# EAGLE design UsbKerb (EAGLE 7.5.0)
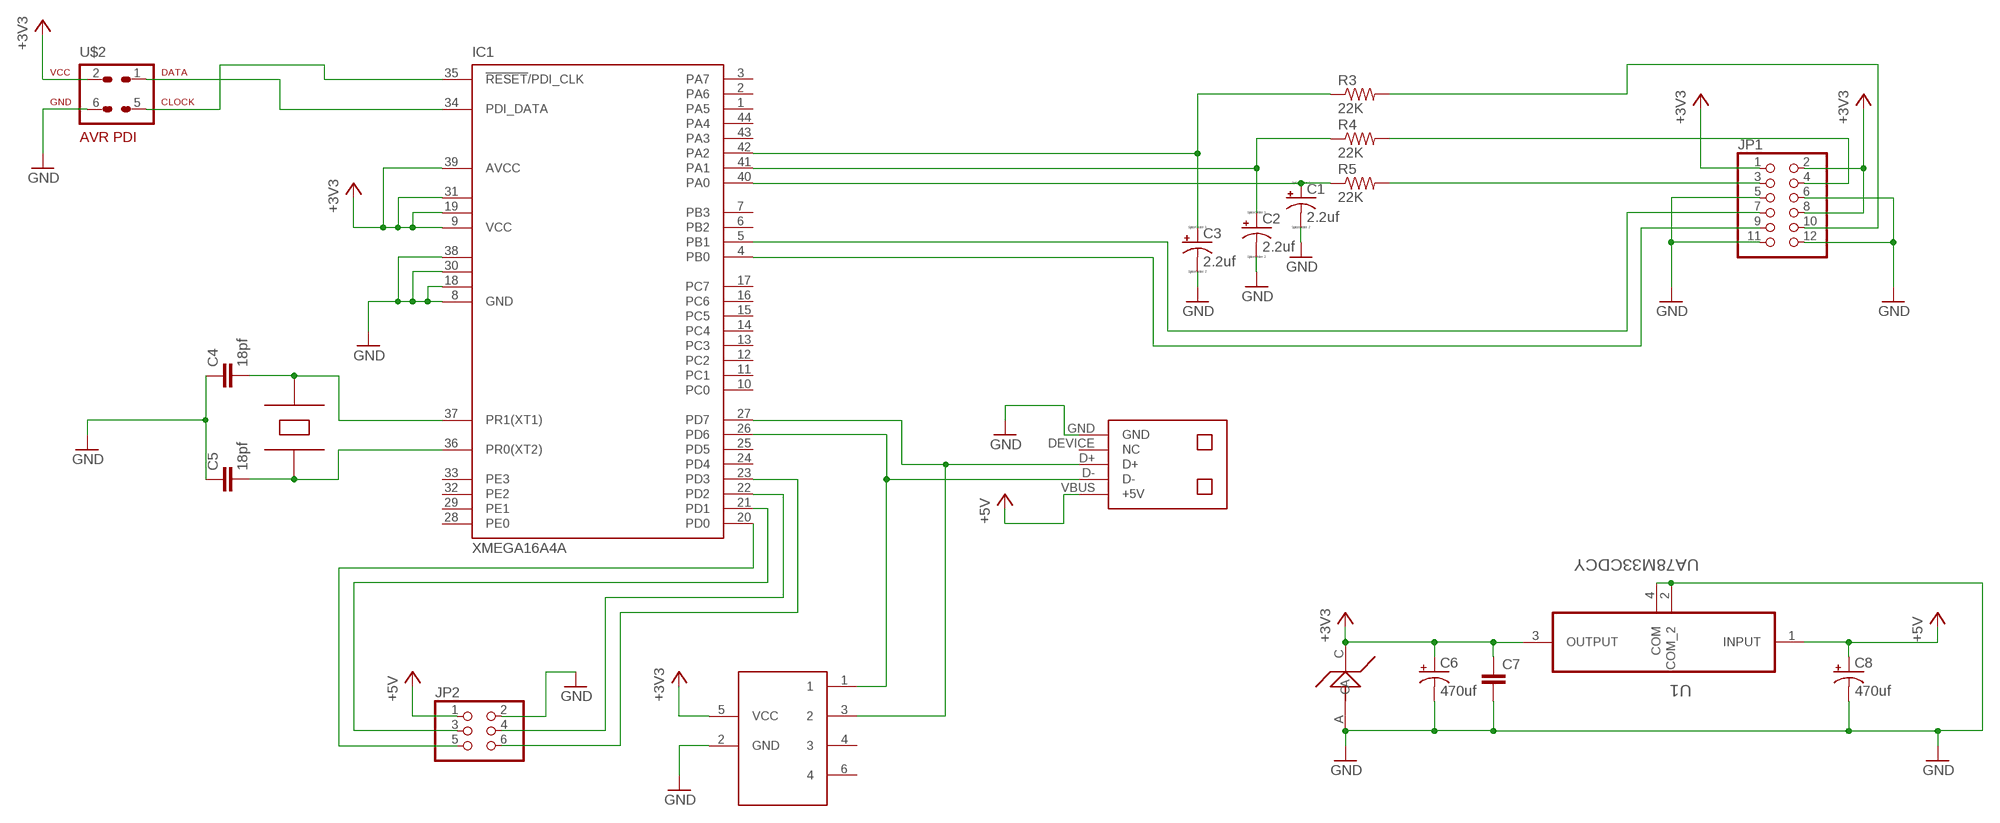
[diagram p0: schematic, sheet 1]

## Parts
C1  2.2uf  CPOL-USB  [PANASONIC_B]
C2  2.2uf  CPOL-USB  [PANASONIC_B]
C3  2.2uf  CPOL-USB  [PANASONIC_B]
C4  18pf  C-EUC0805K  [C0805K]
C5  18pf  C-EUC0805K  [C0805K]
C6  470uf  CPOL-USG  [PANASONIC_G]
C7  C-EUC1206K  [C1206K]
C8  470uf  CPOL-USG  [PANASONIC_G]
IC1  XMEGA16A4A  [TQFP44]
JP1  PINHD-2X6  [2X06]
JP2  PINHD-2X3  [2X03]
R3  22K  R-US_R0805W  [R0805W]
R4  22K  R-US_R0805W  [R0805W]
R5  22K  R-US_R0805W  [R0805W]
U1  UA78M33CDCY  [SOT230P700X180-4N]
U2  3.3TVS  [SOT23-6L]
U$1  USB-MINI  [USB-MINI]
U$2  AVR-PDIVERT  [AVR-ISP-6]
U$3  TVS  [DO214AC]
U$4  12MHZ  [12MHZ]

## Nets
+3V3: C6.+ C7.1 IC1.9(VCC) IC1.19(VCC1) IC1.31(VCC2) IC1.39(AVCC) JP1.1 JP1.2 JP1.8 U1.3(OUTPUT) U2.5(VCC) U$2.2 U$3.C
+5V: C8.+ JP2.1 U1.1(INPUT) U$1.VBUS(+5V)
GND: C1.- C2.- C3.- C4.1 C5.1 C6.- C7.2 C8.- IC1.8(GND) IC1.18(GND1) IC1.30(GND2) IC1.38(GND3) JP1.5 JP1.6 JP1.11 JP1.12 JP2.2 U1.2(COM_2) U1.4(COM) U2.2(GND) U$1.GND U$2.6 U$3.A
N$1: C1.+ IC1.40(PA0) R5.1
N$2: IC1.27(PD7) U2.3 U$1.D+
N$3: IC1.34(PDI_DATA) U$2.1
N$4: IC1.26(PD6) U2.1 U$1.D-
N$5: C2.+ IC1.41(PA1) R4.1
N$6: C3.+ IC1.42(PA2) R3.1
N$7: IC1.35(!RESET!/PDI_CLK) U$2.5
N$8: JP1.10 R3.2
N$9: JP1.4 R4.2
N$10: JP1.3 R5.2
N$11: IC1.4(PB0) JP1.9
N$12: IC1.5(PB1) JP1.7
N$13: C4.2 IC1.37(PR1(XT1)) U$4.P$1
N$14: C5.2 IC1.36(PR0(XT2)) U$4.P$2
N$16: IC1.22(PD2) JP2.4
N$17: IC1.20(PD0) JP2.5
N$18: IC1.21(PD1) JP2.3
N$19: IC1.23(PD3) JP2.6
Unconnected: IC1.1(PA5) IC1.2(PA6) IC1.3(PA7) IC1.6(PB2) IC1.7(PB3) IC1.10(PC0) IC1.11(PC1) IC1.12(PC2) IC1.13(PC3) IC1.14(PC4) IC1.15(PC5) IC1.16(PC6) IC1.17(PC7) IC1.24(PD4) IC1.25(PD5) IC1.28(PE0) IC1.29(PE1) IC1.32(PE2) IC1.33(PE3) IC1.43(PA3) IC1.44(PA4) U2.4 U2.6 U$1.DEVICE(NC)

## Library data of the parts
C1-C3 = resistor:CPOL-US: POLARIZED CAPACITOR, American symbol
C4 C5 = rcl:C-EU: CAPACITOR, European symbol
C6 C8 = rcl:CPOL-US: POLARIZED CAPACITOR, American symbol
C7 = resistor:C-EU: CAPACITOR, European symbol
IC1 = atmel:XMEGA16A4: MICROCONTROLLER Features High-performance, Low-power 8/16-bit AVR XMEGA Microcontroller Non-Volatile Program and Data Memories - 16 KB - 128 KB of In-System Self-Programmable Flash - 4 KB - 8 KB Boot Code Section with Independent Lock Bits - 1 KB - 2 KB EEPROM - 2 KB - 8 KB Internal SRAM Peripheral Features - Four-channel DMA Controller with support for external requests - Eight-channel Event System - Five 16-bit Timer/Counters Three Timer/Counters with 4 Output Compare or Input Capture channels Two Timer/Counters with 2 Output Compare or Input Capture channels High-Resolution Extensions on all Timer/Counters Advanced Waveform Extension on one Timer/Counter - Five USARTs IrDA Extension on one USART - Two Two-Wire Interfaces with dual address match (I2C and SMBus compatible) - Two SPIs (Serial Peripheral Interfaces) peripherals - AES and DES Crypto Engine - 16-bit Real Time Counter with Separate Oscillator - One Twelve-channel, 12-bit, 2 Msps Analog to Digital Converter - One Two-channel, 12-bit, 1 Msps Digital to Analog Converter - Two Analog Comparators with Window compare function - External Interrupts on all General Purpose I/O pins - Programmable Watchdog Timer with Separate On-chip Ultra Low Power Oscillator Special Microcontroller Features - Power-on Reset and Programmable Brown-out Detection - Internal and External Clock Options with PLL - Programmable Multi-level Interrupt Controller - Sleep Modes: Idle, Power-down, Standby, Power-save, Extended Standby - Advanced Programming, Test and Debugging Interfaces PDI (Program and Debug Interface) for programming, test and debugging I/O and Packages - 34 Programmable I/O Lines - 44 - lead TQFP - 44 - pad VQFN/QFN - 49 - ball VFBGA Operating Voltage - 1.6 - 3.6V Speed performance - 0 - 12 MHz @ 1.6 - 3.6V - 0 - 32 MHz @ 2.7 - 3.6V Drawn by Dipl.-Ing. (FH) Robert Siegler Created: 27.05.09; OC_FARNELL: unknown; OC_NEWARK: unknown
JP1 = pinhead:PINHD-2X6: PIN HEADER
JP2 = pinhead:PINHD-2X3: PIN HEADER
R3-R5 = resistor:R-US_: RESISTOR, American symbol
U1 = usb:UA78M33CDCY: IC, LINEAR VOLT REGULATOR, 3.3V, SOT-223-4; MPN: UA78M33CDCY; OC_FARNELL: 2296031; OC_NEWARK: 03P0895; PACKAGE: SOT-223-4; SUPPLIER: TEXAS INSTRUMENTS
U2 = usb:3.3TVS
U$1 = usb:USB-MINI
U$2 = avr-7:AVR-PDI: AVR PDI programming interface connector
U$3 = usb:TVS
U$4 = usb:12MHZ

## Board
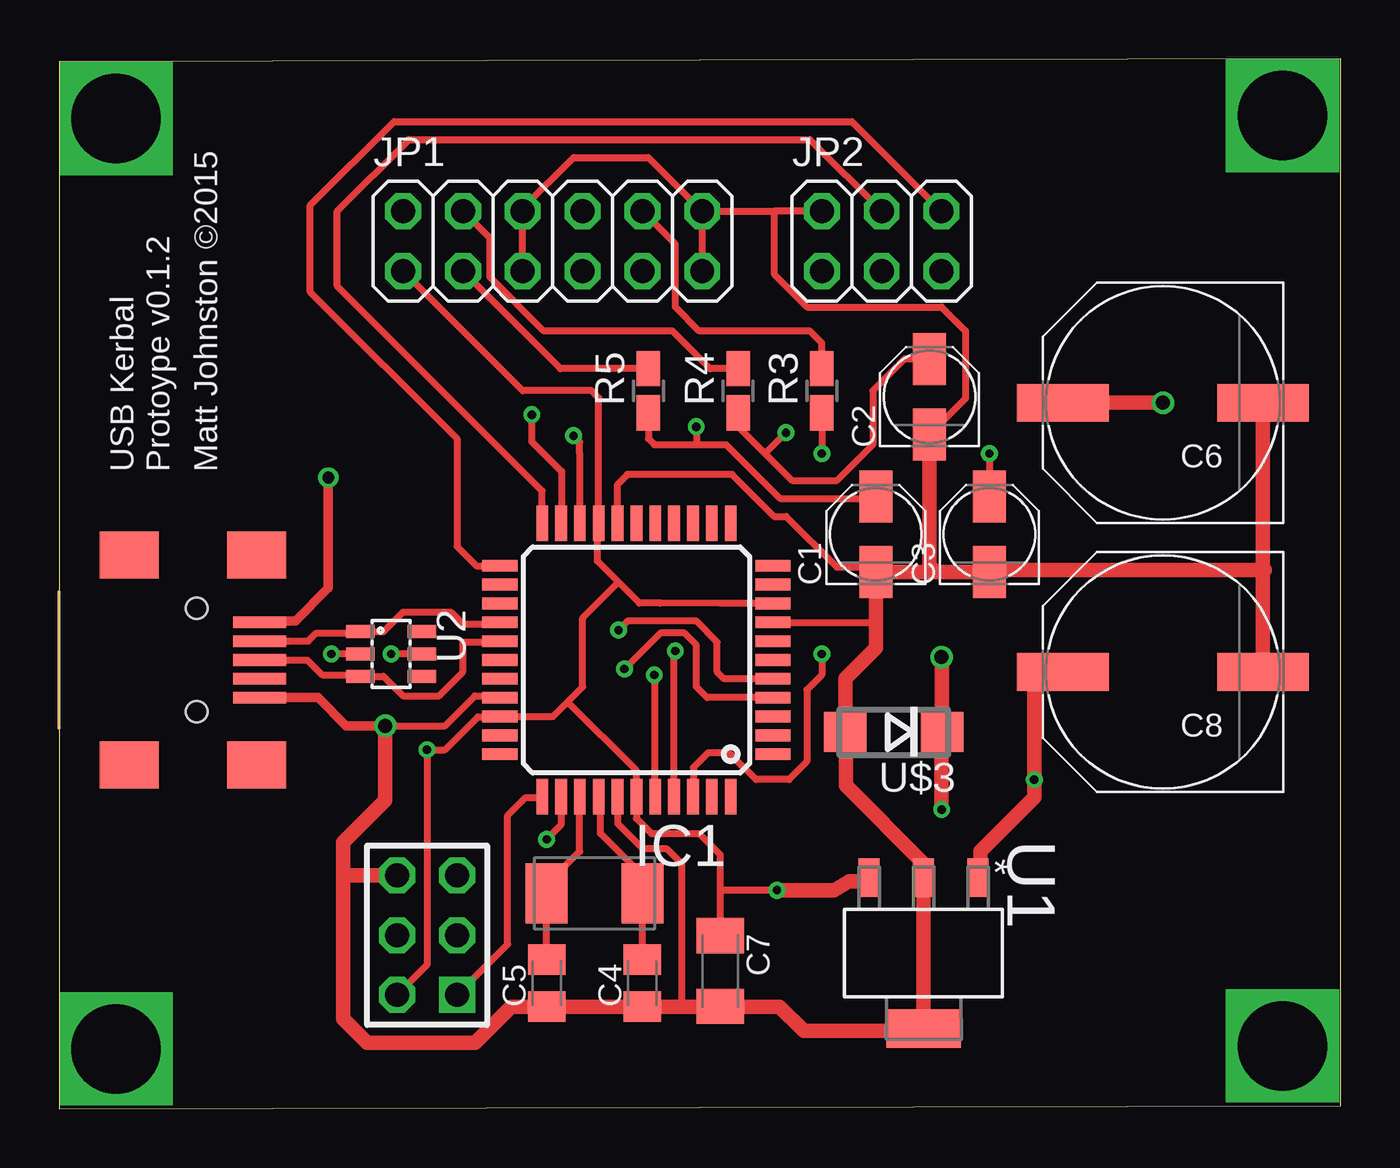
[diagram p1: board, top side]
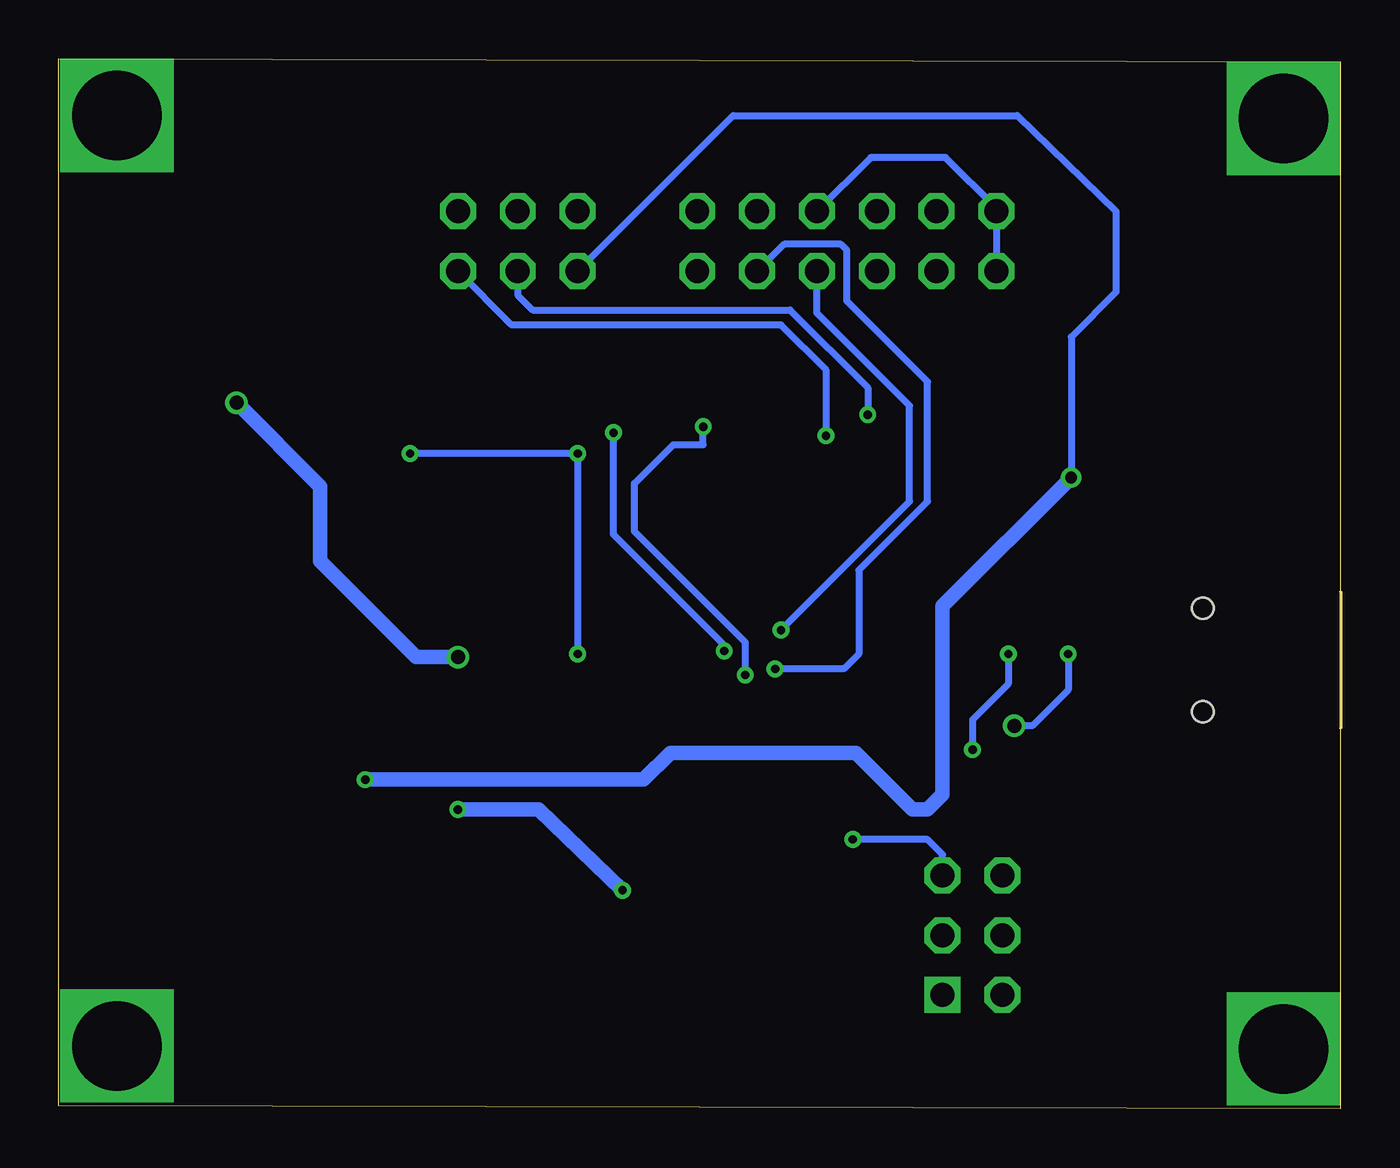
[diagram p2: board, bottom side, seen from below]

Size 54.41 x 44.57 mm. Coordinates in mm from the lower left corner, seen from the top.
Outline: 0.01,0 54.41,0.13 54.41,44.57 0.01,44.44 0.01,0
Copper layers (1*16): Top 0.0356mm / dielectric 1.5011mm / Bottom 0.0356mm
Design rules "LaenPCBOrder": minimum track width 6mil, minimum drill 13mil, track to track 6mil, track to pad 6mil, pad to pad 6mil, via to via 6mil, smd to smd 6mil, copper to edge 15mil, drill to drill 6mil, minimum pad ring 7mil, minimum via ring 7mil, stop-mask expansion 3mil, vias tented up to drill 0mil, thermal gap 10mil

### Footprints (pad centres in the part's own frame; a part is rotated, then mirrored left to right if it is on the bottom)
PANASONIC_B = smd 2.2 x 1.4: + 1.6,0; - -1.6,0
C0805K = smd 1.3 x 1.6: 1 -1,0; 2 1,0
PANASONIC_G = smd 3.9 x 1.6: + 4.25,0; - -4.25,0
C1206K = smd 1.5 x 2: 1 -1.5,0; 2 1.5,0
TQFP44 = smd 1.5 x 0.5: 1 -5.8,4; 2 -5.8,3.2; 3 -5.8,2.4; 4 -5.8,1.6; 5 -5.8,0.8; 6 -5.8,0; 7 -5.8,-0.8; 8 -5.8,-1.6; 9 -5.8,-2.4; 10 -5.8,-3.2; 11 -5.8,-4; 23 5.8,-4; 24 5.8,-3.2; 25 5.8,-2.4; 26 5.8,-1.6; 27 5.8,-0.8; 28 5.8,0; 29 5.8,0.8; 30 5.8,1.6; 31 5.8,2.4; 32 5.8,3.2; 33 5.8,4 | smd 0.5 x 1.5: 12 -4,-5.8; 13 -3.2,-5.8; 14 -2.4,-5.8; 15 -1.6,-5.8; 16 -0.8,-5.8; 17 0,-5.8; 18 0.8,-5.8; 19 1.6,-5.8; 20 2.4,-5.8; 21 3.2,-5.8; 22 4,-5.8; 34 4,5.8; 35 3.2,5.8; 36 2.4,5.8; 37 1.6,5.8; 38 0.8,5.8; 39 0,5.8; 40 -0.8,5.8; 41 -1.6,5.8; 42 -2.4,5.8; 43 -3.2,5.8; 44 -4,5.8
2X06 = drill 1.016 octagon: 1 -6.35,-1.27; 2 -6.35,1.27; 3 -3.81,-1.27; 4 -3.81,1.27; 5 -1.27,-1.27; 6 -1.27,1.27; 7 1.27,-1.27; 8 1.27,1.27; 9 3.81,-1.27; 10 3.81,1.27; 11 6.35,-1.27; 12 6.35,1.27
2X03 = drill 1.016 octagon: 1 -2.54,-1.27; 2 -2.54,1.27; 3 0,-1.27; 4 0,1.27; 5 2.54,-1.27; 6 2.54,1.27
R0805W = smd 1.5 x 1: 1 -0.94,0; 2 0.94,0
SOT230P700X180-4N = smd 1.626 x 0.889: 1 -3.2,2.311; 2 -3.2,0; 3 -3.2,-2.311 | smd 1.626 x 3.175: 4 3.2,0
SOT23-6L = smd 0.55 x 1.2: 1 -0.95,-1.3; 2 0,-1.3; 3 0.95,-1.3; 4 0.95,1.3; 5 0,1.3; 6 -0.95,1.3
USB-MINI = smd 0.5 x 2.25: D+ 0,2.675; D- -0.8,2.675; DEVICE 0.8,2.675; GND 1.6,2.675; VBUS -1.6,2.675 | smd 2 x 2.5: P$6 -4.45,-2.87; P$7 4.45,2.55; P$8 4.45,-2.87; P$9 -4.45,2.55 | hole 0.9: 2.2,0; -2.2,0
AVR-ISP-6 = drill 1.016 square: 1 -2.54,-1.27 | drill 1.016 octagon: 2 -2.54,1.27; 3 0,-1.27; 4 0,1.27; 5 2.54,-1.27; 6 2.54,1.27
DO214AC = smd 1.8 x 1.7: A 2.05,0; C -2.05,0
12MHZ = smd 1.778 x 2.54: P$1 -2.032,0; P$2 2.032,0

### Placement (x,y rotation side)
C1  34.68,24.38 90 top
C2  36.97,30.23 90 top
C3  39.51,24.38 90 top
C4  24.77,5.33 90 top
C5  20.71,5.33 90 top
C6  46.87,29.97 180 top
C7  28.08,5.84 270 top
C8  46.87,18.54 180 top
IC1  24.52,19.05 180 top
JP1  20.96,36.83 0 top
JP2  34.93,36.83 0 top
R3  32.39,30.48 90 top
R4  28.84,30.48 90 top
R5  25.03,30.48 90 top
U1  36.71,6.6 270 top
U2  14.1,19.3 270 top
U$1  5.85,19.05 270 top
U$2  15.63,7.37 90 top
U$3  35.44,16 180 top
U$4  22.74,9.14 180 top

### Tracks (layer width: path | path; a pad name or v marks a point on that pad's centre or on a via)
+3V3  (via drill 0.36 pad 0.18, 0.36 pad 0.41, 0.6)
  Top 0.305: IC1.9 28.09,21.45 25.54,21.46 24.65,21.46 23.76,22.35 | 23.76,22.35 22.87,23.24 22.87,24.8 IC1.19 22.92,30.18 22.61,30.48 19.69,30.48 JP1.1 | 21.6,17.27 20.98,16.65 IC1.31 18.71,16.64 17.79,16.64 16.39,15.24 v15.63,15.24 15.63,6.1 U$2.2 | 21.6,17.27 22.23,17.91 22.23,20.83 23.76,22.35 | 21.6,17.27 24.52,14.35 IC1.39 24.52,12.32 25.15,11.68 27.19,11.68 28.08,10.79 28.08,9.14 | U2.5 v14.1,19.3 | v30.49,9.27 28.2,9.27 28.08,9.14 | 28.08,9.14 C7.1
  Top 0.61: v37.47,12.7 37.47,15.98 U$3.C 37.49,19.16 v37.47,19.18 | v46.87,29.97 C6.+ | v30.49,9.27 32.9,9.27 33.54,9.65 34.25,9.65 U1.3
  Bottom 0.305: JP1.1 JP1.2 14.61,38.23 16.77,40.39 19.95,40.39 JP1.8 | v14.1,19.3 14.1,18.03 15.63,16.51 v15.63,15.24
  Bottom 0.61: v37.47,12.7 34.04,12.7 v30.49,9.27 | v37.47,19.18 39.25,19.18 43.32,23.24 43.32,26.42 v46.87,29.97
+5V  (via drill 0.36 pad 0.41, 0.5 pad 0.25)
  Top 0.406: v11.44,26.8 11.44,22.1 10.04,20.7 8.58,20.7 U$1.VBUS
  Top 0.61: C8.+ 41.41,18.54 v41.41,13.97 41.41,13.21 39.12,10.92 39.12,9.91 U1.1
  Bottom 0.305: JP2.1 25.79,42.16 13.72,42.16 9.53,38.1 9.53,34.67 11.44,32.77 v11.44,26.8
  Bottom 0.61: v41.41,13.97 29.6,13.97 28.46,15.11 20.58,15.11 18.17,12.7 17.53,12.7 16.9,13.34 16.9,21.34 v11.44,26.8
GND  (via drill 0.36 pad 0.18, 0.6)
  Top 0.305: U2.2 v11.56,19.3 | v13.85,16.26 16.39,16.26 17.66,17.53 18.64,17.53 IC1.30 | IC1.8 34.6,20.65 34.68,20.57 | JP1.5 JP1.6 19.69,38.23 21.85,40.39 25.03,40.39 JP1.12 | JP1.12 JP1.11 | JP1.12 30.36,38.1 | JP2.2 30.36,38.1 | 30.36,38.1 30.36,35.43 31.76,34.04 37.47,34.04 38.49,33.02 38.49,30.15 C2.- | IC1.38 23.72,12.1 24.77,11.05 25.79,11.05 26.42,10.41 26.42,4.46 26.55,4.33 | IC1.18 23.72,26.5 24.14,26.92 28.58,26.92 30.36,25.15 30.87,25.15 33.03,22.99 34.48,22.99 C1.-
  Top 0.406: U$1.GND 11.01,17.45 12.2,16.26 v13.85,16.26
  Top 0.61: 12.07,9.91 12.07,3.81 13.09,2.79 17.66,2.79 19.2,4.33 C5.1 C4.1 26.55,4.33 C7.2 28.08,4.33 30.6,4.33 31.63,3.3 36.61,3.3 U1.4 U1.2 36.71,10.41 33.41,13.72 33.41,15.98 U$3.A 33.39,18.27 34.68,19.56 34.68,20.57 C1.- 37.22,22.78 | 12.07,9.91 12.07,11.3 13.85,13.08 v13.85,16.26 | C6.- C8.- 51.12,22.79 51.19,22.86 39.58,22.86 C3.- 37.22,22.78 | C2.- 36.97,23.04 37.22,22.78 | U$2.6 12.07,9.91
  Bottom 0.305: v11.56,19.3 11.56,17.78 13.09,16.26 v13.85,16.26
N$1  (via drill 0.36 pad 0.18)
  Top 0.305: R5.1 25.03,28.45 25.28,28.19 27.06,28.19 | 27.06,28.19 28.33,28.19 30.62,25.91 34.6,25.91 C1.+ | v27.06,28.96 27.06,28.19 | v25.28,18.41 25.28,13.29 IC1.40
  Bottom 0.305: v27.06,28.96 27.06,28.19 28.33,28.19 29.98,26.54 29.98,24.51 25.28,19.81 v25.28,18.41
N$2
  Top 0.305: IC1.27 18.68,19.81 17.15,19.81 17.15,18.54 16.14,17.53 14.61,17.53 13.79,18.35 U2.3 12.74,18.41 11.18,18.41 10.55,19.05 U$1.D+
N$3
  Top 0.305: U$2.1 19.06,6.99 19.06,12.45 19.82,13.21 20.48,13.21 IC1.34
N$4
  Top 0.305: IC1.26 18.64,20.57 17.15,20.57 16.65,21.08 14.61,21.08 13.79,20.25 U2.1 12.74,20.19 10.93,20.19 10.59,19.85 U$1.D-
N$5  (via drill 0.36 pad 0.18)
  Top 0.305: C2.+ 35.9,31.83 34.55,30.48 34.55,28.19 33.03,26.67 31.12,26.67 29.98,27.81 | IC1.41 26.12,19.38 v26.17,19.43 | R4.1 28.84,28.96 29.98,27.81 | v30.87,28.7 29.98,27.81
  Bottom 0.305: v30.87,28.7 30.87,24.38 26.17,19.68 v26.17,19.43
N$6  (via drill 0.36 pad 0.18)
  Top 0.305: R3.1 v32.39,27.81 | v39.51,27.81 C3.+ | v32.39,19.3 32.39,18.41 31.76,17.78 31.76,14.73 31,13.97 29.6,13.97 28.46,15.11 27.57,15.11 26.93,14.48 26.93,13.26 IC1.42
  Bottom 0.305: v32.39,19.3 v32.39,27.81 v39.51,27.81
N$7  (via drill 0.36 pad 0.18)
  Top 0.305: 21.34,13.22 IC1.35 21.32,12.04 v20.71,11.43
  Bottom 0.305: U$2.5 16.9,10.79 17.53,11.43 v20.71,11.43
N$8
  Top 0.305: R3.2 32.39,32.51 31.89,33.02 27.19,33.02 26.17,34.04 26.17,36.7 JP1.10
N$9
  Top 0.305: R4.2 27.64,31.42 26.04,33.02 20.58,33.02 18.3,35.31 18.3,36.96 JP1.4
N$10
  Top 0.305: R5.2 21.29,31.42 JP1.3
N$11  (via drill 0.36 pad 0.18)
  Top 0.305: IC1.4 27.52,17.45 27.06,17.91 27.06,19.68 26.55,20.19 25.54,20.19 v24.01,18.67
  Bottom 0.305: JP1.9 23.63,36.7 21.22,36.7 20.96,36.45 20.96,34.29 17.53,30.86 17.53,25.78 20.45,22.86 20.45,19.3 21.09,18.67 v24.01,18.67
N$12  (via drill 0.36 pad 0.18)
  Top 0.305: IC1.5 28.24,18.25 27.95,18.54 27.95,19.81 27.06,20.7 24.14,20.7 v23.76,20.32
  Bottom 0.305: v23.76,20.32 18.3,25.78 18.3,29.84 22.23,33.78 JP1.7
N$13
  Top 0.305: IC1.37 22.99,13.17 22.99,11.68 24.77,9.91 U$4.P$1 C4.2
N$14
  Top 0.305: C5.2 U$4.P$2 20.71,9.91 21.09,9.91 22.11,10.92 22.11,13.24 IC1.36
N$16
  Top 0.305: IC1.22 20.52,26.23 11.82,34.92 11.82,38.1 14.87,41.15 31.89,41.15 JP2.4
N$17  (via drill 0.36 pad 0.18)
  Top 0.305: IC1.20 22.12,27.8 22.11,27.81 22.11,28.32 v21.85,28.57
  Bottom 0.305: v21.85,28.57 21.85,31.37 23.76,33.27 35.19,33.27 JP2.5
N$18  (via drill 0.36 pad 0.18)
  Top 0.305: v20.07,29.46 20.07,28.32 21.34,27.05 21.34,24.82 IC1.21
  Bottom 0.305: JP2.3 34.93,34.54 34.3,33.91 23.38,33.91 20.07,30.61 v20.07,29.46
N$19
  Top 0.305: 18.23,23.05 IC1.23 17.73,23.05 16.9,23.88 16.9,28.45 10.68,34.67 10.68,38.35 14.23,41.91 33.66,41.91 JP2.6
N$20  (via drill 3.8)
  other vias: 2.42,2.54
N$21  (via drill 3.8)
  other vias: 2.42,42.04
N$22  (via drill 3.8)
  other vias: 51.95,42.16
N$23  (via drill 3.8)
  other vias: 51.95,2.67

### Text on the board
tPlace: USB Kerbal / Protoype v0.1.2 | Matt Johnston ©2015